# EAGLE design Arduino-Bluetooth-Shield (EAGLE 5.11)
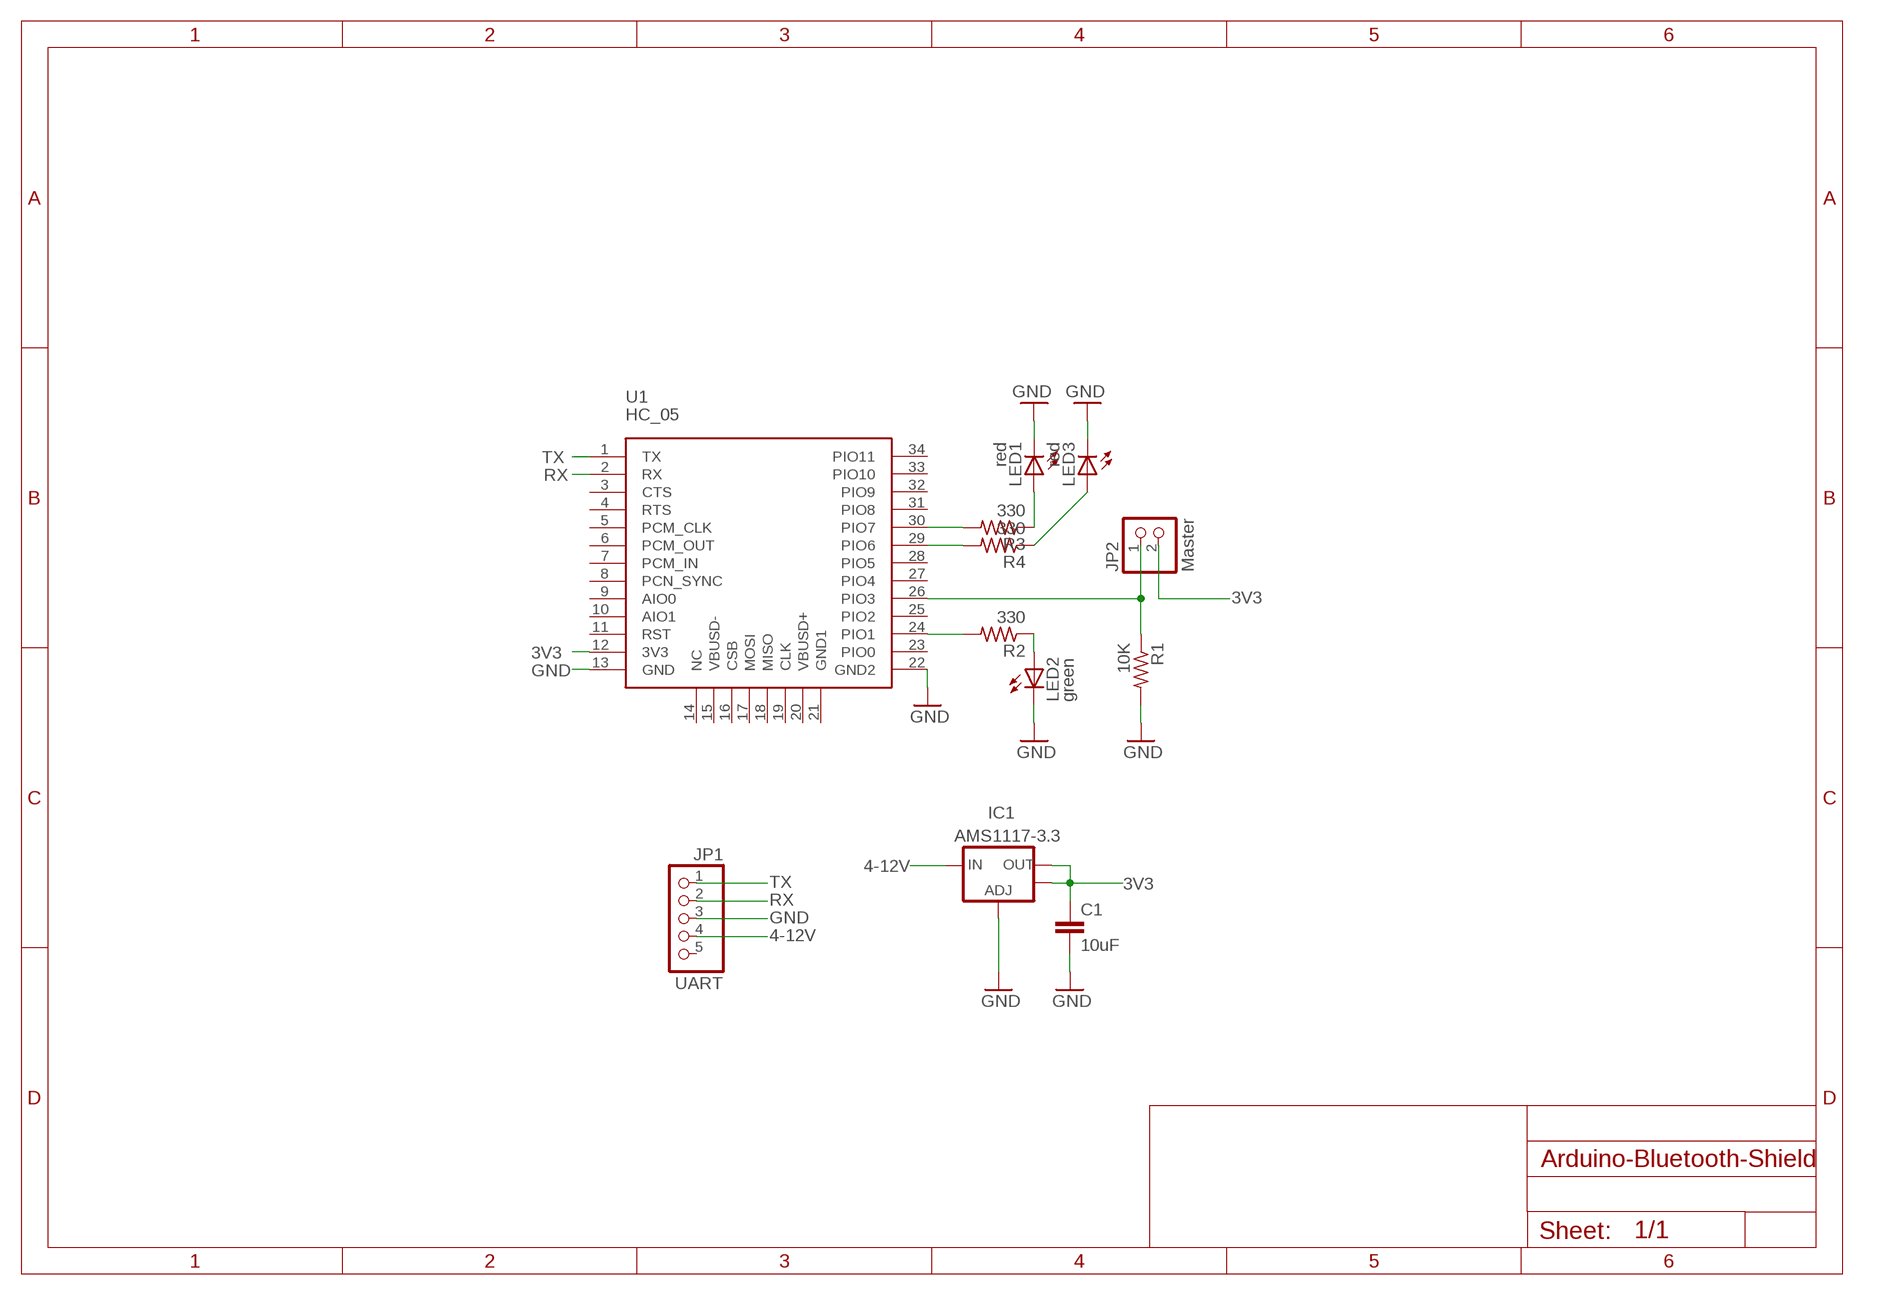
[diagram p0: schematic, sheet 1]

## Parts
C1  10uF  C-EUC0805  [C0805]
IC1  AMS1117-3.3  V_REG_LM1117SOT223  [SOT223]
JP1  UART  PINHD-1X05_2.54-S  [1X05-S]
JP2  Master  PINHD-1X02_2.54-S  [1X02-S]
LED1  red  LEDCHIP-LED0805  [CHIP-LED0805]
LED2  green  LEDCHIP-LED0805  [CHIP-LED0805]
LED3  red  LEDCHIP-LED0805  [CHIP-LED0805]
R1  10K  R-US_R0805  [R0805]
R2  330  R-US_R0805  [R0805]
R3  330  R-US_R0805  [R0805]
R4  330  R-US_R0805  [R0805]
U1  HC_05  [BLUETOOTH_SMD]

## Nets
3V3: C1.1 IC1.2(OUT) IC1.4(OUT) JP2.2 U1.12(3V3)
4-12V: IC1.3(IN) JP1.4
GND: C1.2 IC1.1(ADJ) JP1.3 LED1.C LED2.C LED3.C R1.2 U1.13(GND) U1.22(GND2)
N$1: LED2.A R2.1
N$3: JP2.1 R1.1 U1.26(PIO3)
N$4: R4.2 U1.29(PIO6)
N$5: R3.2 U1.30(PIO7)
N$7: LED3.A R4.1
N$8: LED1.A R3.1
PIO1: R2.2 U1.24(PIO1)
RX: JP1.2 U1.2(RX)
TX: JP1.1 U1.1(TX)
Unconnected: JP1.5 U1.3(CTS) U1.4(RTS) U1.5(PCM_CLK) U1.6(PCM_OUT) U1.7(PCM_IN) U1.8(PCN_SYNC) U1.9(AIO0) U1.10(AIO1) U1.11(RST) U1.14(NC) U1.15(VBUSD-) U1.16(CSB) U1.17(MOSI) U1.18(MISO) U1.19(CLK) U1.20(VBUSD+) U1.21(GND1) U1.23(PIO0) U1.25(PIO2) U1.27(PIO4) U1.28(PIO5) U1.31(PIO8) U1.32(PIO9) U1.33(PIO10) U1.34(PIO11)

## Library data of the parts
C1 = resistor:C-EU: CAPACITOR, European symbol
IC1 = SparkFun:V_REG_LM1117: Voltage Regulator LM1117 Standard adjustable voltage regulator but in SMD form. Spark Fun Electronics SKU : COM-00595
JP1 = pinhead-2:PINHD-1X05: PIN HEADER
JP2 = pinhead-2:PINHD-1X02: PIN HEADER
LED1-LED3 = led:LED: LED OSRAM: - CHIPLED LG R971, LG N971, LY N971, LG Q971, LY Q971, LO R971, LY R971 LH N974, LH R974 LS Q976, LO Q976, LY Q976 LO Q996 - Hyper CHIPLED LW Q18S LB Q993, LB Q99A, LB R99A - SideLED LS A670, LO A670, LY A670, LG A670, LP A670 LB A673, LV A673, LT A673, LW A673 LH A674 LY A675 LS A676, LA A676, LO A676, LY A676, LW A676 LS A679, LY A679, LG A679 - Hyper Micro SIDELED® LS Y876, LA Y876, LO Y876, LY Y876 LT Y87S - SmartLED LW L88C, LW L88S LB L89C, LB L89S, LG L890 LS L89K, LO L89K, LY L89K LS L896, LA L896, LO L896, LY L896 - TOPLED LS T670, LO T670, LY T670, LG T670, LP T670 LSG T670, LSP T670, LSY T670, LOP T670, LYG T670 LG T671, LOG T671, LSG T671 LB T673, LV T673, LT T673, LW T673 LH T674 LS T676, LA T676, LO T676, LY T676, LB T676, LH T676, LSB T676, LW T676 LB T67C, LV T67C, LT T67C, LS T67K, LO T67K, LY T67K, LW E67C LS E67B, LA E67B, LO E67B, LY E67B, LB E67C, LV E67C, LT E67C LW T67C LS T679, LY T679, LG T679 LS T770, LO T770, LY T770, LG T770, LP T770 LB T773, LV T773, LT T773, LW T773 LH T774 LS E675, LA E675, LY E675, LS T675 LS T776, LA T776, LO T776, LY T776, LB T776 LHGB T686 LT T68C, LB T68C - Hyper Mini TOPLED® LB M676 - Mini TOPLED Santana® LG M470 LS M47K, LO M47K, LY M47K Source: http://www.osram.convergy.de LUXEON: - LUMILED® LXK2-PW12-R00, LXK2-PW12-S00, LXK2-PW14-U00, LXK2-PW14-V00 LXK2-PM12-R00, LXK2-PM12-S00, LXK2-PM14-U00 LXK2-PE12-Q00, LXK2-PE12-R00, LXK2-PE12-S00, LXK2-PE14-T00, LXK2-PE14-U00 LXK2-PB12-K00, LXK2-PB12-L00, LXK2-PB12-M00, LXK2-PB14-N00, LXK2-PB14-P00, LXK2-PB14-Q00 LXK2-PR12-L00, LXK2-PR12-M00, LXK2-PR14-Q00, LXK2-PR14-R00 LXK2-PD12-Q00, LXK2-PD12-R00, LXK2-PD12-S00 LXK2-PH12-R00, LXK2-PH12-S00 LXK2-PL12-P00, LXK2-PL12-Q00, LXK2-PL12-R00 Source: www.luxeon.com KINGBRIGHT: KA-3528ASYC Source: www.kingbright.com
R1-R4 = resistor:R-US_: RESISTOR, American symbol
U1 = SerialPortBluetooth:HC_05

## Board
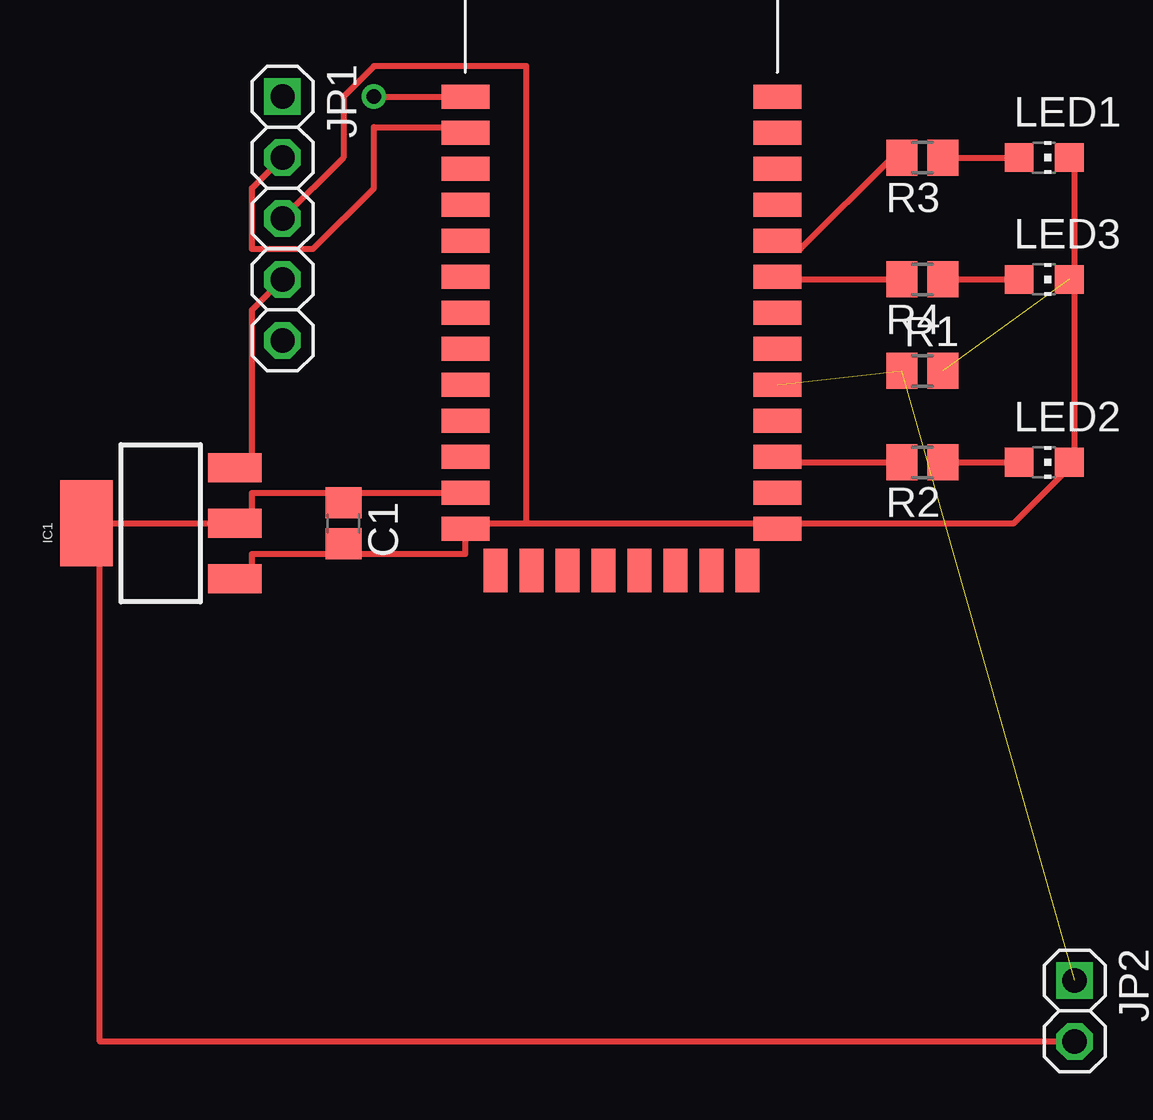
[diagram p1: board, top side]
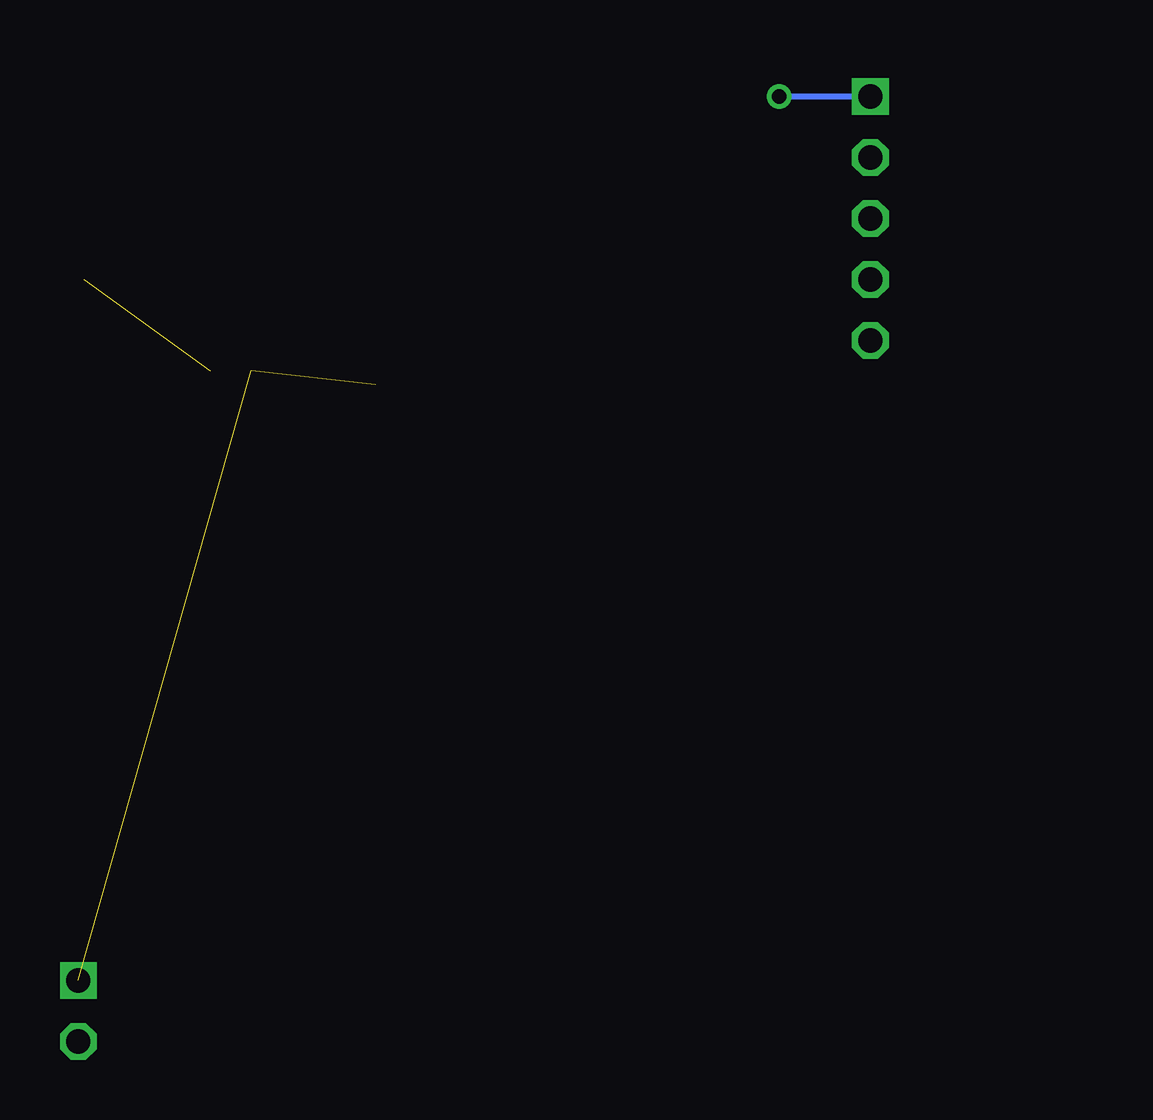
[diagram p2: board, bottom side, seen from below]

No outline drawn. Coordinates in mm, seen from the top.
Copper layers (1*16): Top 0.035mm / dielectric 1.5mm / Bottom 0.035mm
Design rules "default": minimum track width 10mil, minimum drill 24mil, track to track 8mil, track to pad 8mil, pad to pad 8mil, via to via 8mil, smd to smd 8mil, copper to edge 40mil, drill to drill 8mil, minimum pad ring 10mil, minimum via ring 8mil, stop-mask expansion 4mil, vias tented up to drill 0mil, thermal gap 10mil

### Footprints (pad centres in the part's own frame; a part is rotated, then mirrored left to right if it is on the bottom)
C0805 = smd 1.3 x 1.5: 1 -0.85,0; 2 0.85,0
SOT223 = smd 1.219 x 2.235: 1 -2.311,-3.099; 2 0,-3.099; 3 2.311,-3.099 | smd 3.6 x 2.2: 4 0,3.099
1X05-S = drill 1.016 square: 1 -5.08,0 | drill 1.016 octagon: 2 -2.54,0; 3 0,0; 4 2.54,0; 5 5.08,0
1X02-S = drill 1.016 square: 1 -1.27,0 | drill 1.016 octagon: 2 1.27,0
CHIP-LED0805 = smd 1.2 x 1.2: A 0,-1.05; C 0,1.05
R0805 = smd 1.3 x 1.5: 1 -0.85,0; 2 0.85,0
BLUETOOTH_SMD = smd 2 x 1: 1 0,0; 2 0,-1.5; 3 0,-3; 4 0,-4.5; 5 0,-6; 6 0,-7.5; 7 0,-9; 8 0,-10.5; 9 0,-12; 10 0,-13.5; 11 0,-15; 12 0,-16.5; 13 0,-18; 22 13,-18; 23 13,-16.5; 24 13,-15; 25 13,-13.5; 26 13,-12; 27 13,-10.5; 28 13,-9; 29 13,-7.5; 30 13,-6; 31 13,-4.5; 32 13,-3; 33 13,-1.5; 34 13,0 | smd 1 x 1.8: 14 1.25,-19.75; 15 2.75,-19.75; 16 4.25,-19.75; 17 5.75,-19.75; 18 7.25,-19.75; 19 8.75,-19.75; 20 10.25,-19.75; 21 11.75,-19.75

### Placement (x,y rotation side)
C1  15.24,12.7 270 top
IC1  7.62,12.7 90 top
JP1  12.7,25.4 270 top
JP2  45.72,-7.62 270 top
LED1  44.45,27.94 270 top
LED2  44.45,15.24 270 top
LED3  44.45,22.86 270 top
R1  39.37,19.05 0 top
R2  39.37,15.24 180 top
R3  39.37,27.94 180 top
R4  39.37,22.86 180 top
U1  20.32,30.48 0 top

### Tracks (layer width: path | path; a pad name or v marks a point on that pad's centre or on a via)
3V3
  Top 0.254: 15.24,13.97 11.43,13.97 11.43,12.7 IC1.2 10.16,12.7 5.08,12.7 | 15.24,13.97 C1.1 15.24,13.97 | 15.24,13.97 U1.12 | JP2.2 5.08,-8.89 5.08,12.7 | 5.08,12.7 IC1.4 5.08,12.7
4-12V
  Top 0.254: JP1.4 11.43,21.59 11.43,15.24 IC1.3
GND  (1 unrouted)
  Top 0.254: 45.72,15.24 45.72,22.86 | 45.72,15.24 LED2.C 45.72,15.24 | 45.72,22.86 LED3.C 45.72,22.86 | 45.72,22.86 45.72,27.94 LED1.C | 15.24,11.43 11.43,11.43 11.43,10.16 IC1.1 | 15.24,11.43 C1.2 15.24,11.43 | 33.02,12.7 U1.22 | 22.86,12.7 33.02,12.7 | 20.32,12.7 22.86,12.7 | U1.13 20.32,12.7 | 33.02,12.7 U1.22 | JP1.3 15.24,27.94 15.24,30.48 16.51,31.75 22.86,31.75 22.86,12.7 | 15.24,11.43 20.32,11.43 U1.13 | U1.13 20.32,12.7 | U1.13 20.32,12.7 | 45.72,15.24 43.18,12.7 34.29,12.7 U1.22
N$1
  Top 0.254: LED2.A 43.18,15.24 40.64,15.24 R2.1
N$3  (2 unrouted)
N$4
  Top 0.254: R4.2 38.1,22.86 34.29,22.86 U1.29
N$5
  Top 0.254: R3.2 38.1,27.94 34.29,24.13 U1.30
N$7
  Top 0.254: LED3.A 43.18,22.86 40.64,22.86 R4.1
N$8
  Top 0.254: LED1.A 43.18,27.94 40.64,27.94 R3.1
PIO1
  Top 0.254: R2.2 38.1,15.24 34.29,15.24 U1.24
RX
  Top 0.254: JP1.2 11.43,26.67 11.43,24.13 13.97,24.13 16.51,26.67 16.51,29.21 20.32,29.21 U1.2
TX  (via drill 0.61)
  Top 0.254: v16.51,30.48 U1.1
  Bottom 0.254: JP1.1 v16.51,30.48